# Altium schematic sheet GTU原理图目录V1.0-20160311.SCHDOC
size A3
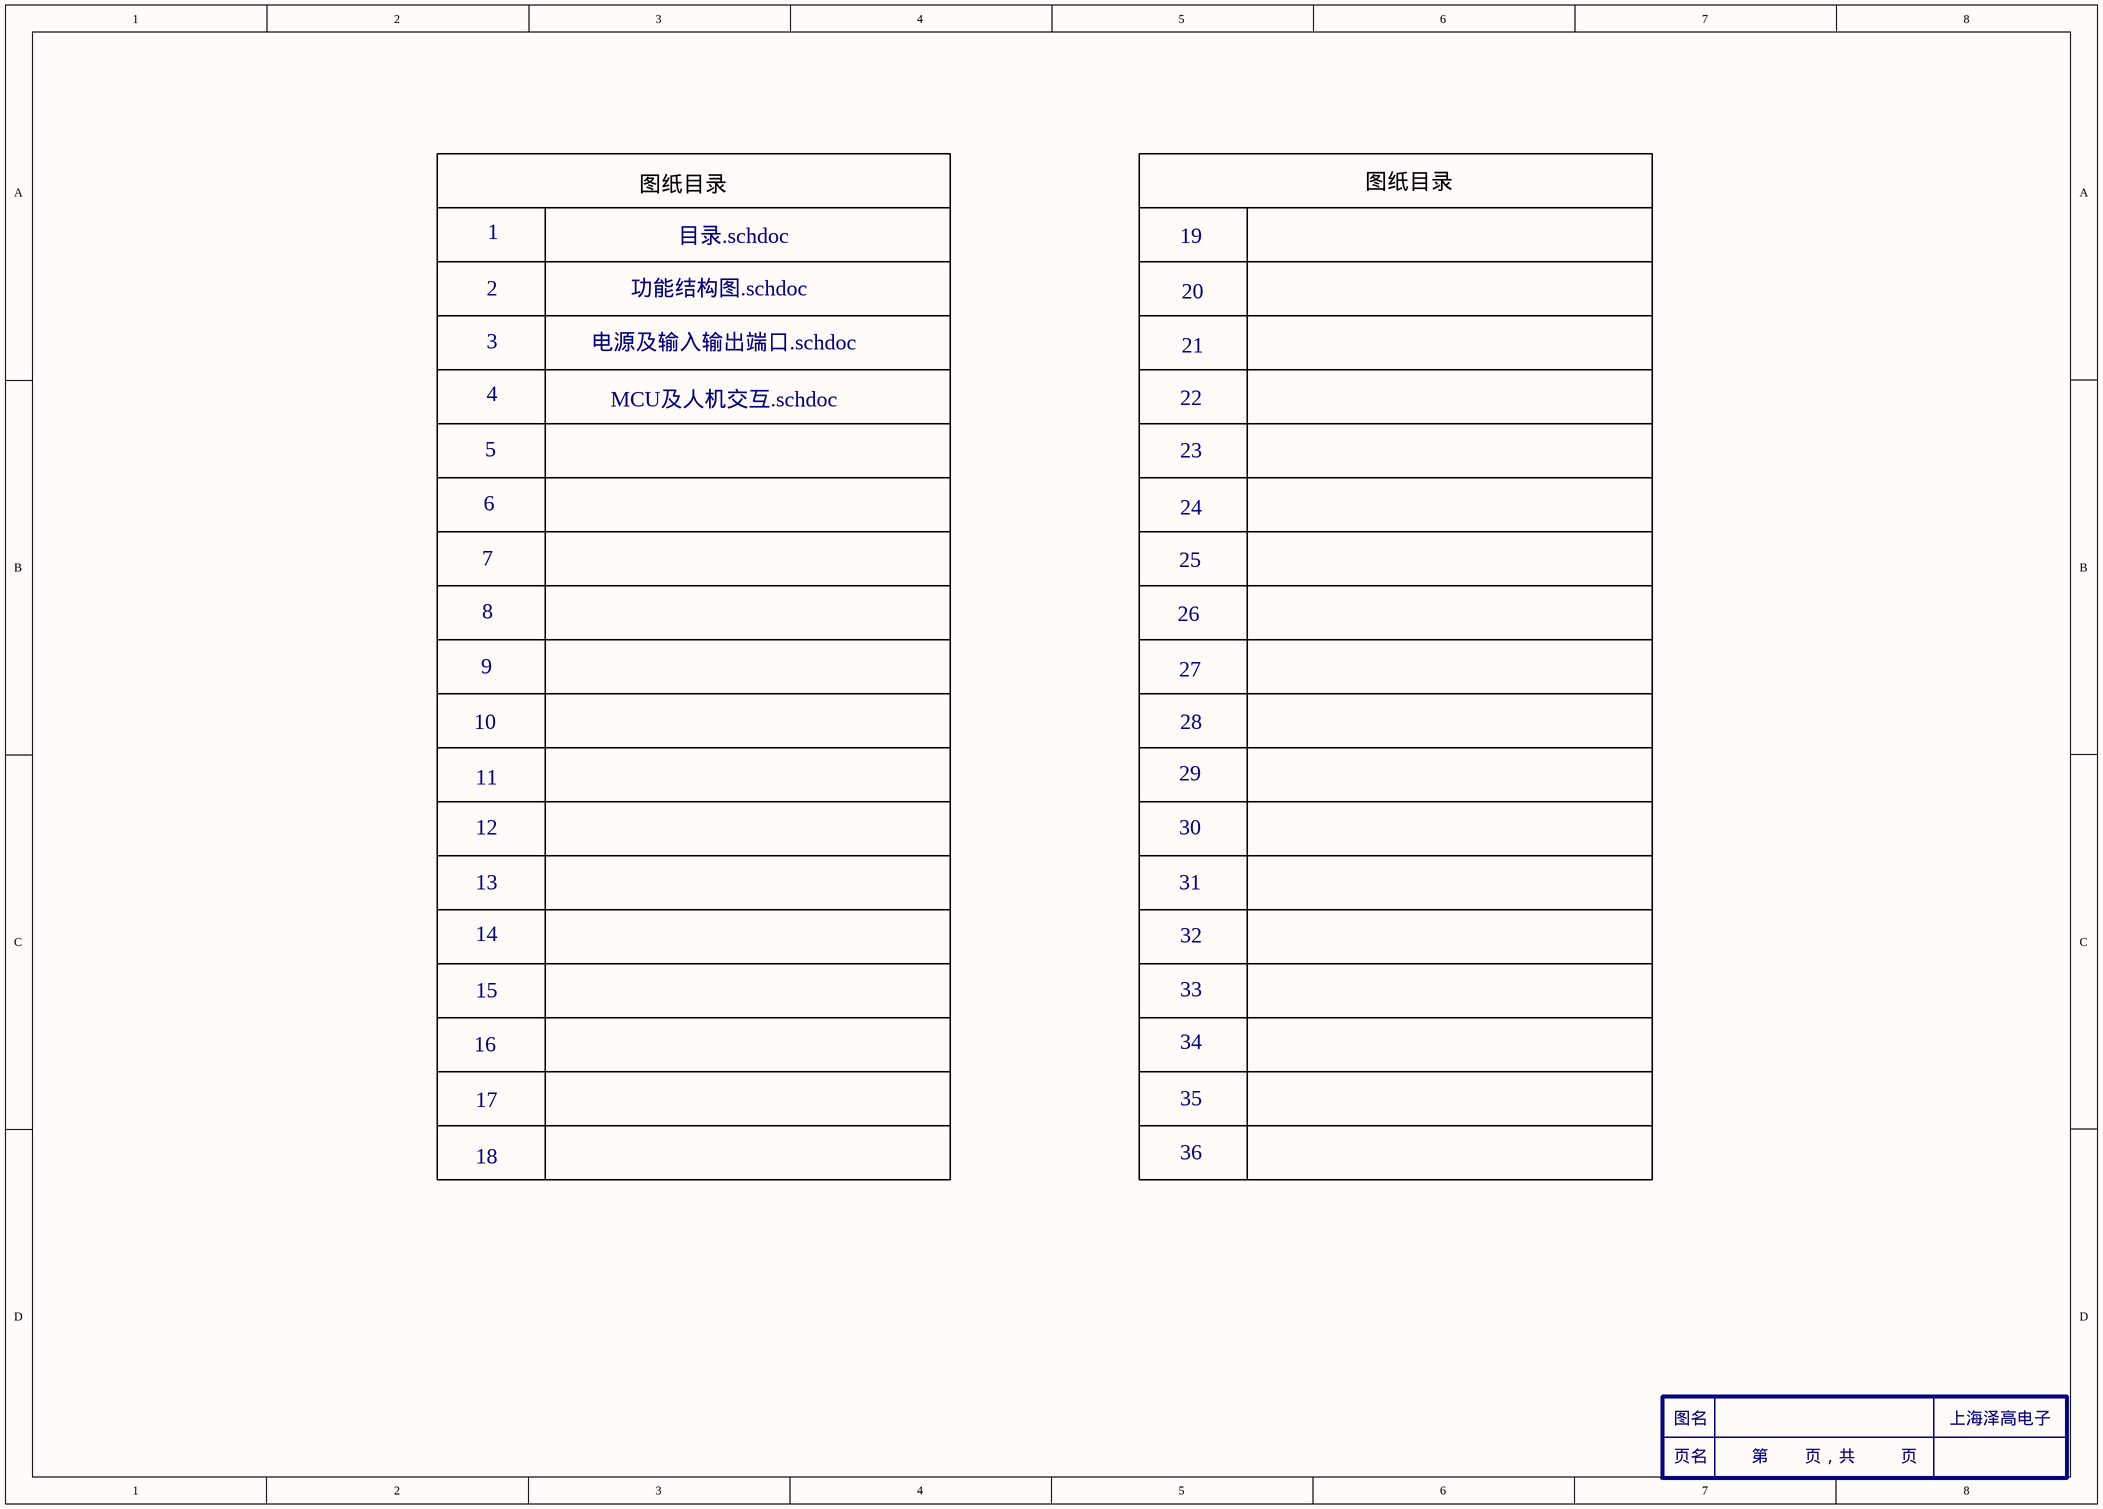
[diagram p0: GTU原理图目录V1.0-20160311.SCHDOC]

## Parts
1  Component_1  (value not drawn)

## Notes on the sheet
- 1
- 图纸目录
- 目录.schdoc
- 19
- 2
- 功能结构图.schdoc
- 20
- 3
- 电源及输入输出端口.schdoc
- 21
- 4
- MCU及人机交互.schdoc
- 22
- 6
- 5
- 23
- 24
- 7
- 25
- 8
- 26
- 9
- 27
- 10
- 11
- 29
- 28
- 12
- 30
- 13
- 31
- 14
- 32
- 16
- 15
- 33
- 34
- 17
- 35
- 18
- 36
- (in symbol Component_1) 图名; 上海泽高电子; 页名; 第        页，共          页